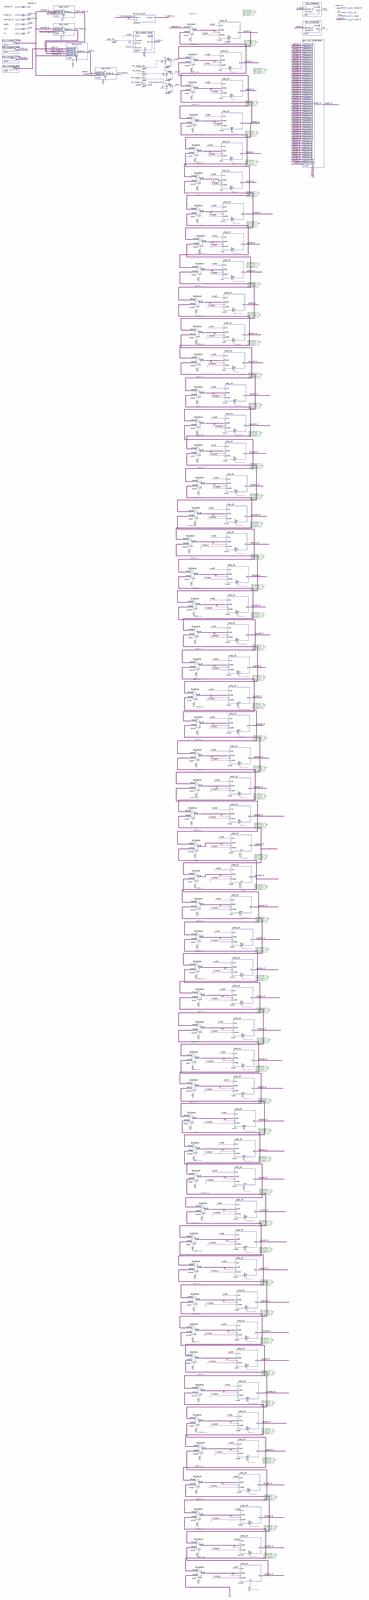
[diagram p0: schematic sheet, whole]
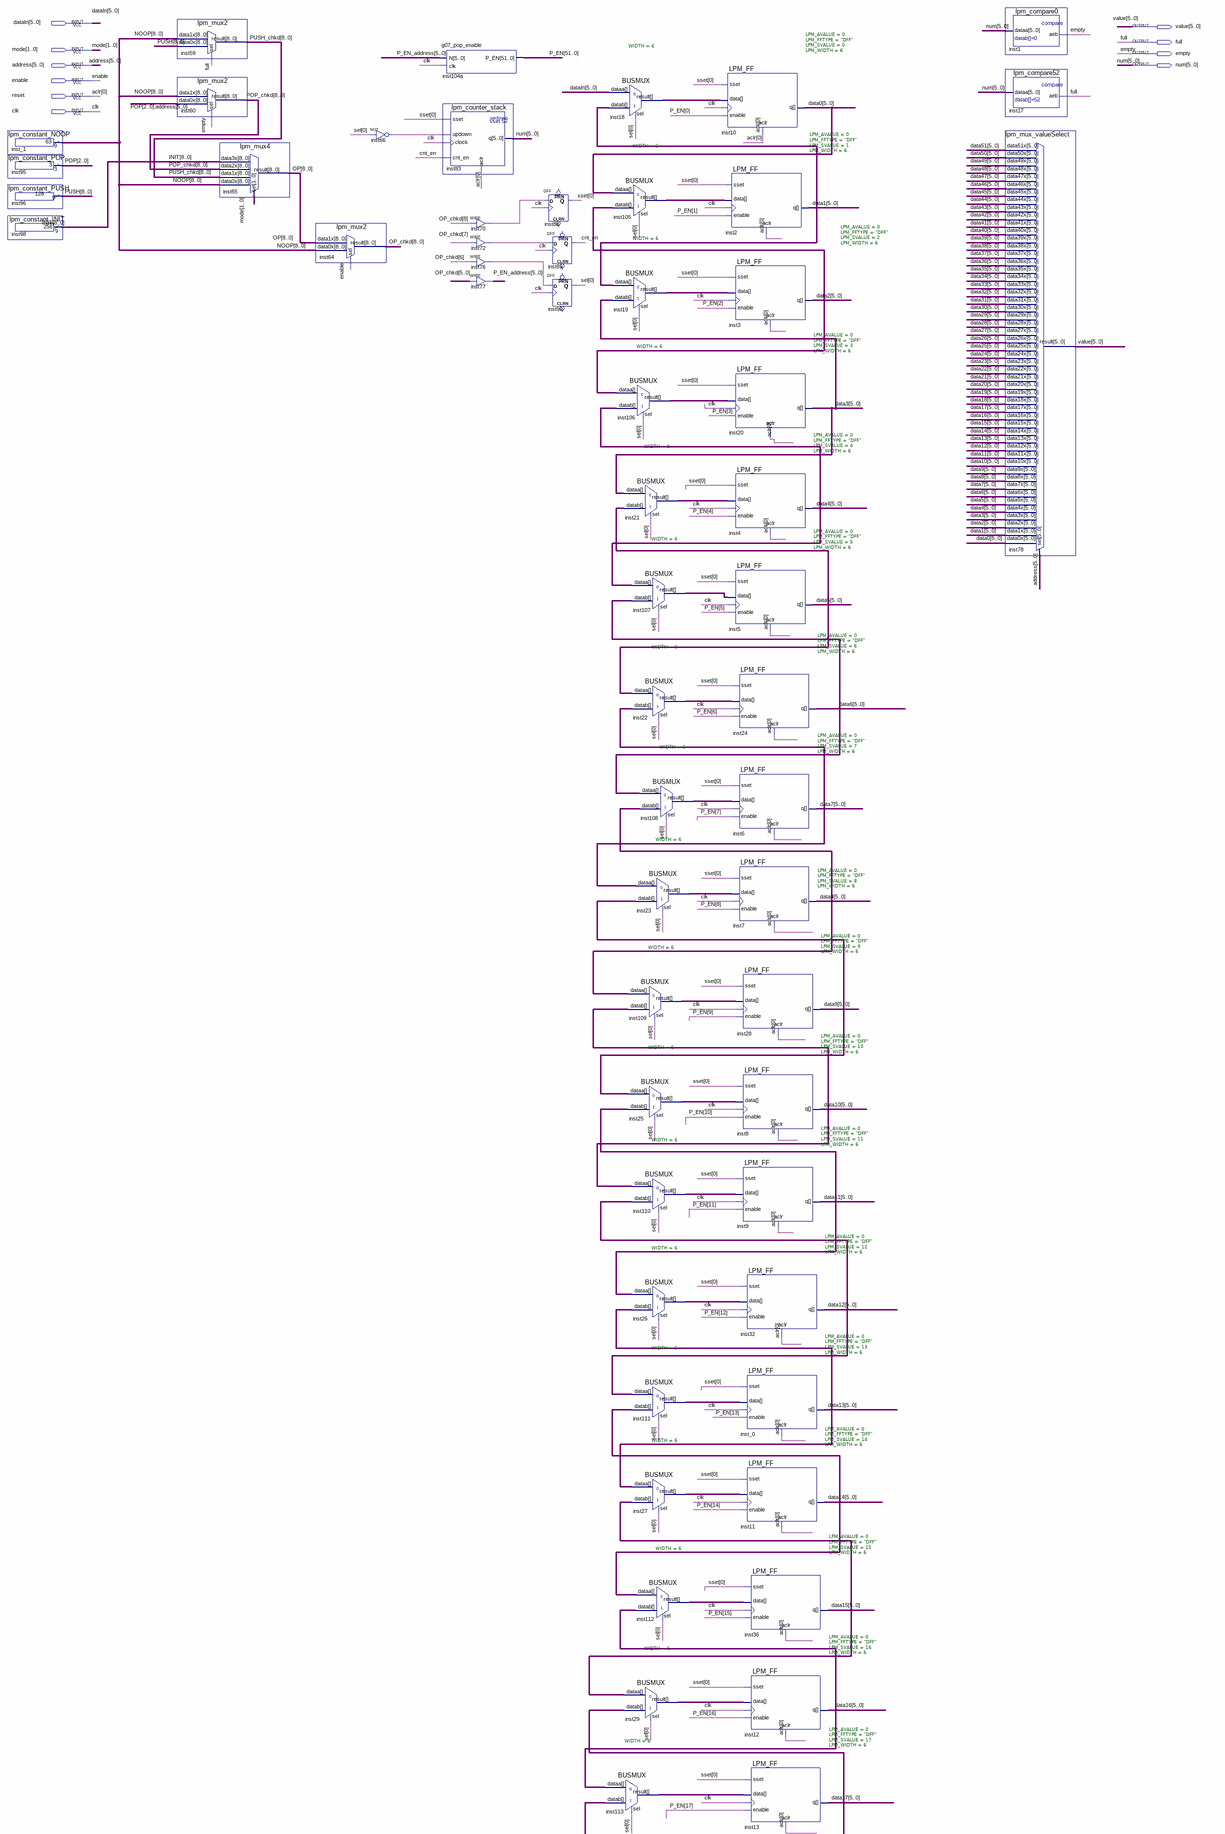
[diagram p1: schematic sheet, upper part]
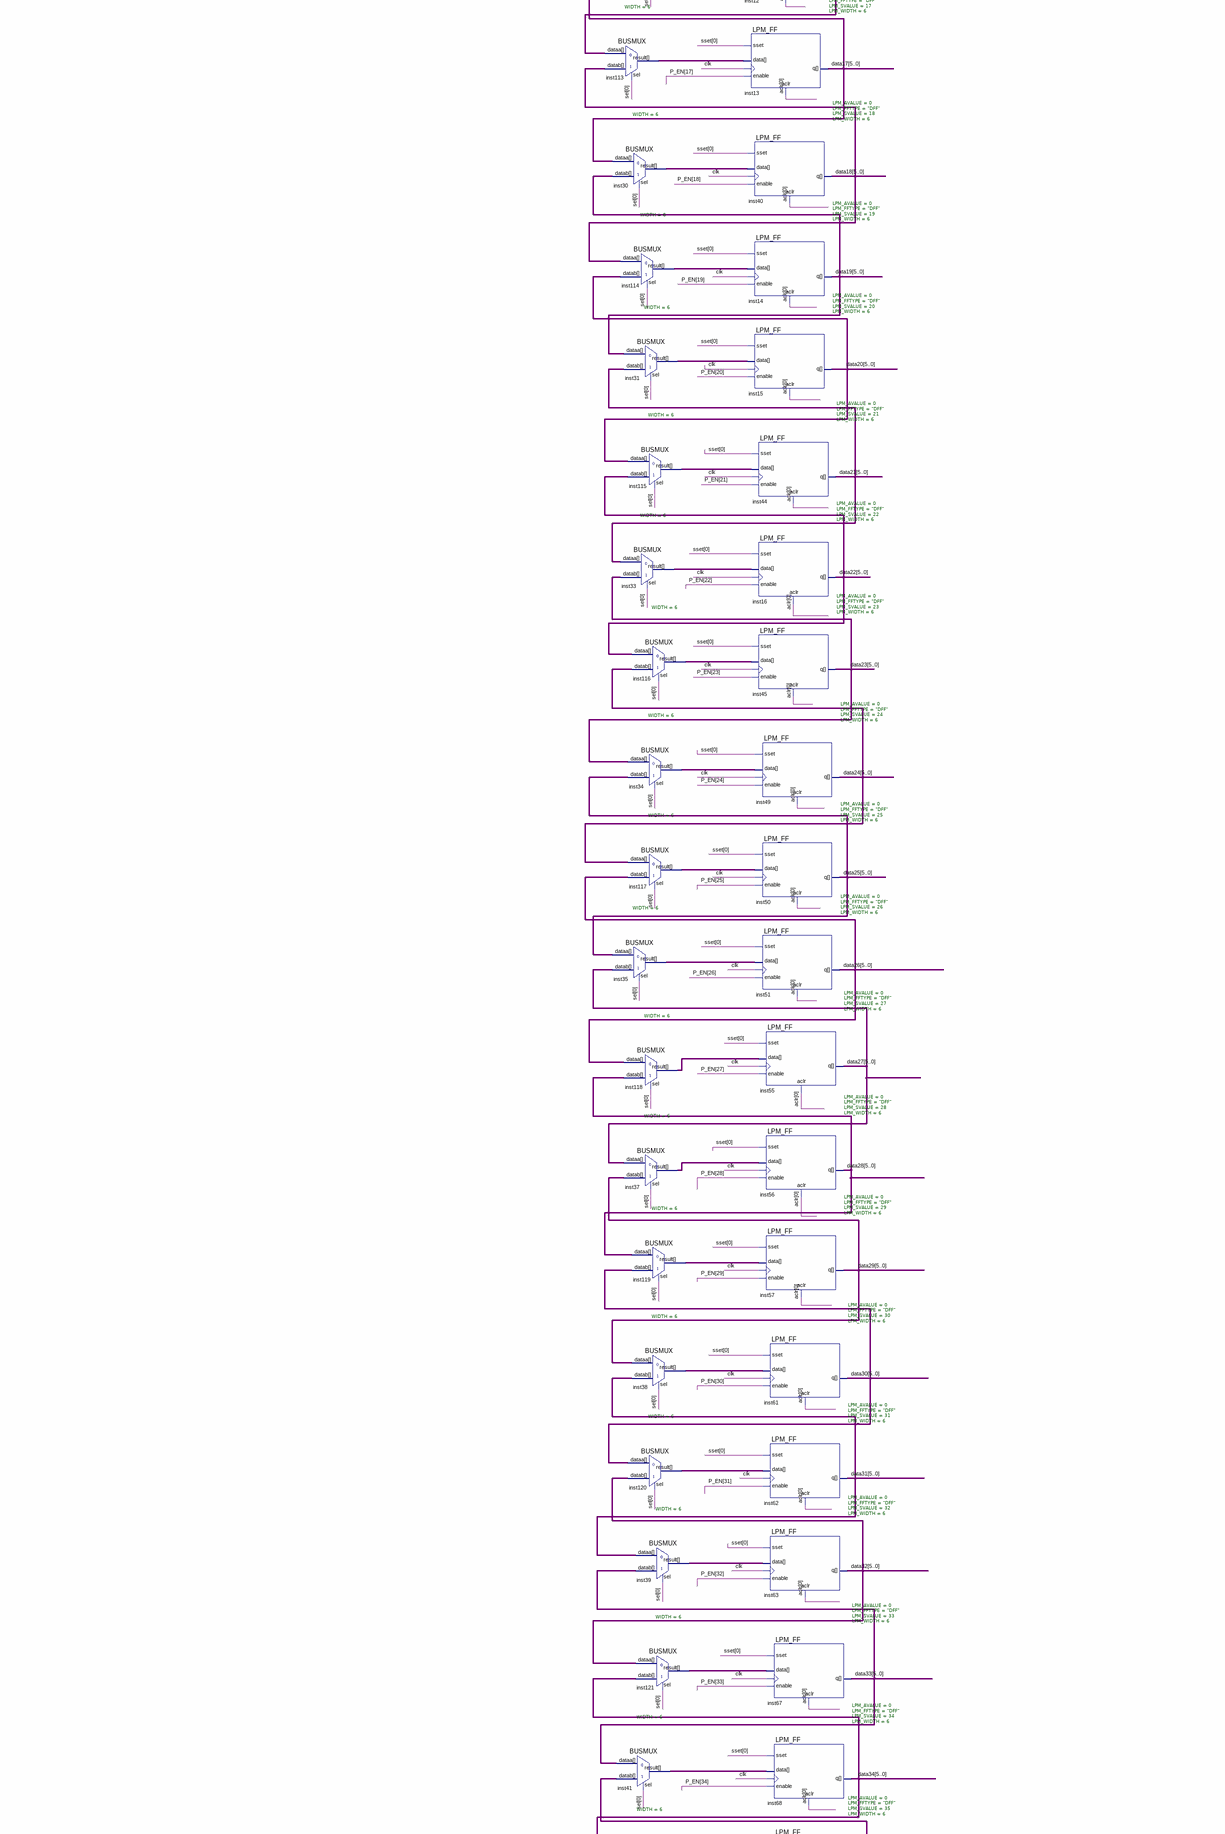
[diagram p2: schematic sheet, middle part]
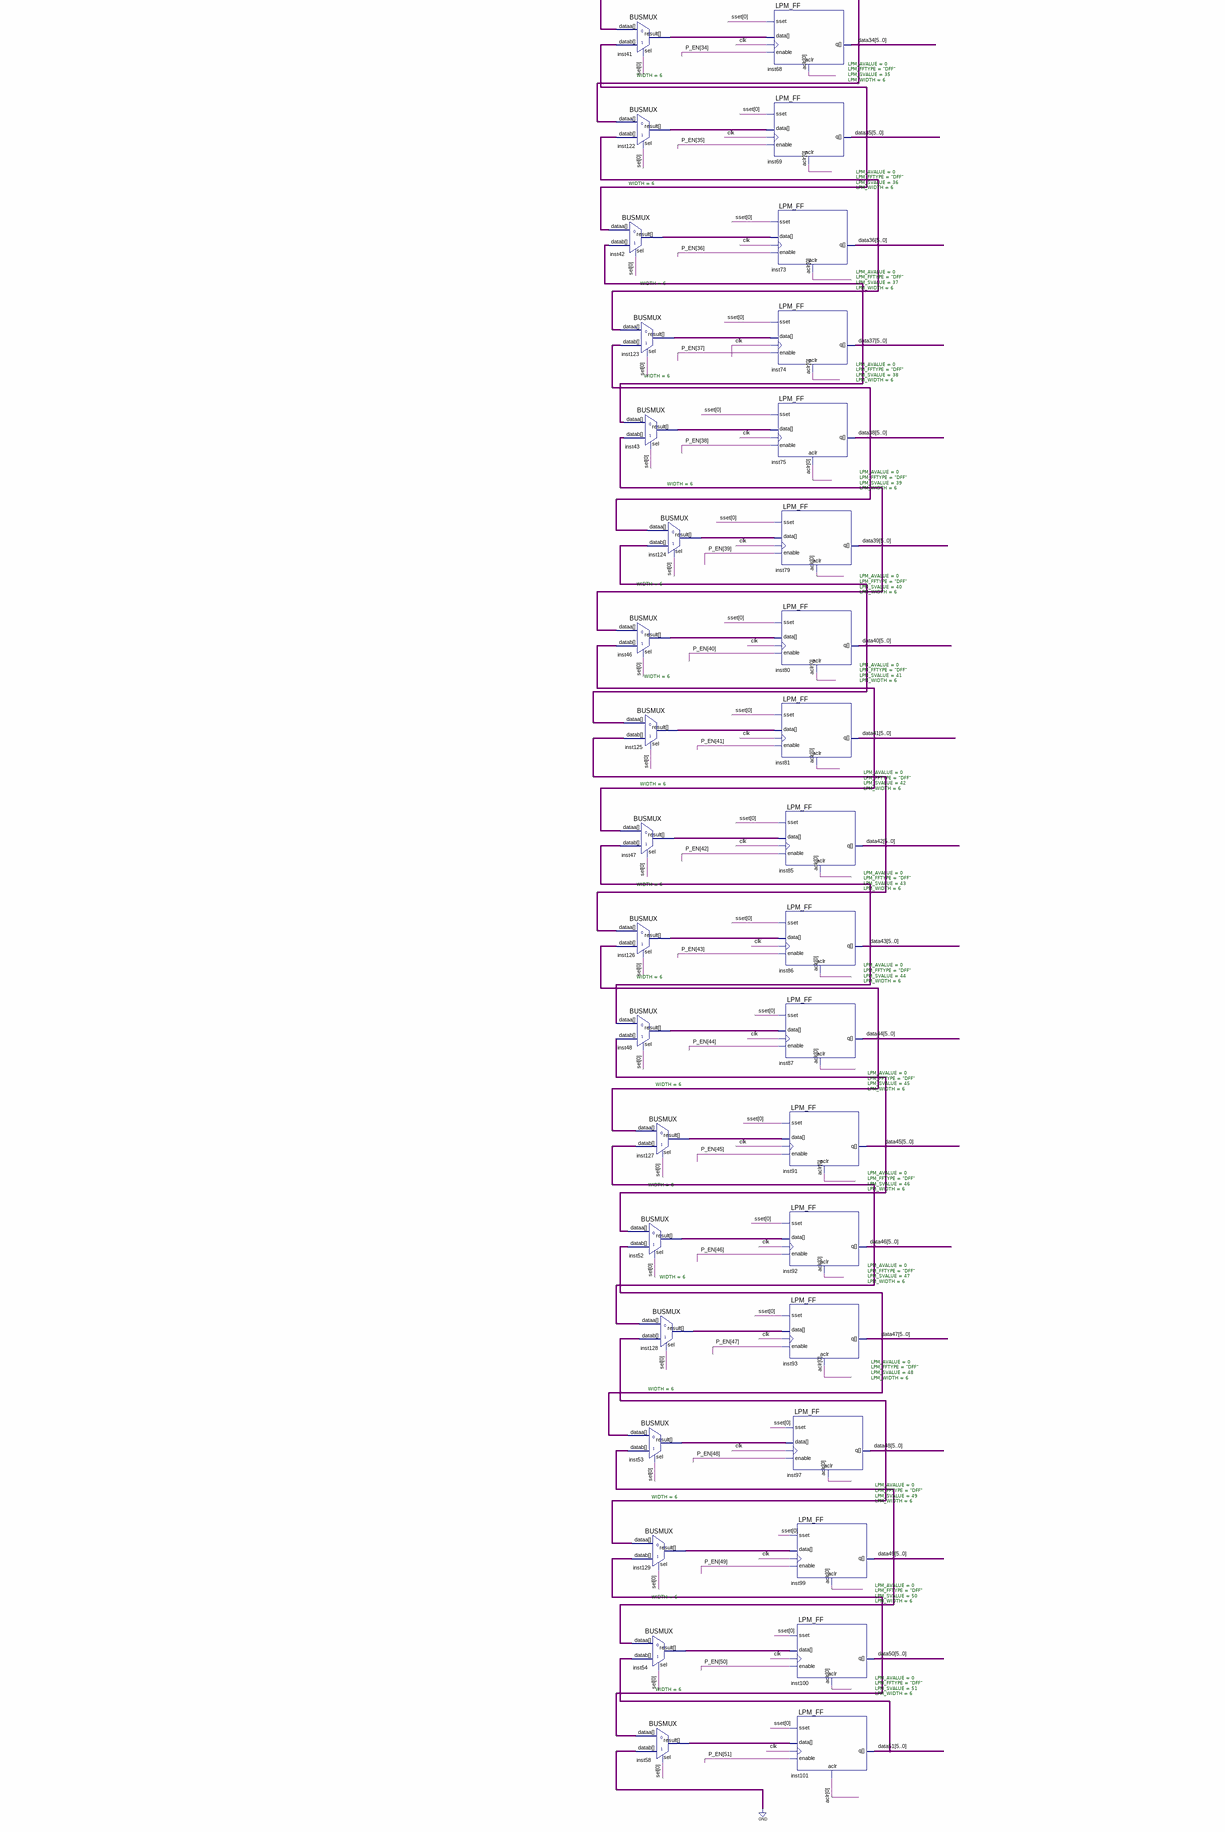
[diagram p3: schematic sheet, lower part]
// Quartus schematic g07_stack52.bdf as structural Verilog: 125 symbols, 10 pins
module g07_stack52 (
  input  [5:0] dataIn,
  input  [1:0] mode,
  input  [5:0] address,
  input  enable,
  input  reset,
  input  clk,
  output [5:0] value,
  output full,
  output empty,
  output [5:0] num
);

  wire cnt_en, inst66_out, inst70_out, inst72_out, inst76_out;
  wire [0:0] sel, sset;
  wire [2:0] POP;
  wire [5:0] data0, data1, data2, data3, data4, data5, data6, data7, data8, data9, data10, data11, data12,
       data13, data14, data15, data16, data17, data18, data19, data20, data21, data22, data23, data24,
       data25, data26, data27, data28, data29, data30, data31, data32, data33, data34, data35, data36,
       data37, data38, data39, data40, data41, data42, data43, data44, data45, data46, data47, data48,
       data49, data50, data51, inst18_result, inst19_result, inst21_result, inst22_result, inst23_result,
       inst25_result, inst26_result, inst27_result, inst29_result, inst30_result, inst31_result,
       inst33_result, inst34_result, inst35_result, inst37_result, inst38_result, inst39_result,
       inst41_result, inst42_result, inst43_result, inst46_result, inst47_result, inst48_result,
       inst52_result, inst53_result, inst54_result, inst58_result, inst105_result, inst106_result,
       inst107_result, inst108_result, inst109_result, inst110_result, inst111_result, inst112_result,
       inst113_result, inst114_result, inst115_result, inst116_result, inst117_result, inst118_result,
       inst119_result, inst120_result, inst121_result, inst122_result, inst123_result, inst124_result,
       inst125_result, inst126_result, inst127_result, inst128_result, inst129_result, P_EN_address;
  wire [8:0] INIT, NOOP, OP, OP_chkd, POP_chkd, PUSH, PUSH_chkd;
  wire [51:0] P_EN;

  lpm_constant_NOOP inst_1 (.result(NOOP));
  lpm_constant_POP inst95 (.result(POP));
  lpm_constant_PUSH inst96 (.result(PUSH));
  lpm_constant_INIT inst98 (.result(INIT));
  lpm_mux2 inst59 (.data1x(NOOP), .data0x(PUSH), .sel(full), .result(PUSH_chkd));
  lpm_mux2 inst60 (.data1x(NOOP), .data0x({POP, address}), .sel(empty), .result(POP_chkd));
  lpm_mux4 inst65 (.data3x(INIT), .data2x(POP_chkd), .data1x(PUSH_chkd), .data0x(NOOP), .sel(mode), .result(OP));
  lpm_mux2 inst64 (.data1x(OP), .data0x(NOOP), .sel(enable), .result(OP_chkd));
  not inst66 (inst66_out, sel[0]);
  g07_pop_enable inst104a (.N(P_EN_address), .clk(clk), .P_EN(P_EN));
  lpm_counter_stack inst83 (.sset(sset[0]), .updown(inst66_out), .clock(clk), .cnt_en(cnt_en), .aclr(reset), .q(num));
  assign inst70_out = OP_chkd[8];  // WIRE inst70
  assign inst72_out = OP_chkd[7];  // WIRE inst72
  assign inst76_out = OP_chkd[6];  // WIRE inst76
  assign P_EN_address = OP_chkd[5:0];  // WIRE inst77
  DFF inst88 (.CLK(clk), .D(inst70_out), .Q(sset[0]));  // open: CLRN, PRN
  DFF inst89 (.CLK(clk), .D(inst72_out), .Q(cnt_en));  // open: CLRN, PRN
  DFF inst90 (.CLK(clk), .D(inst76_out), .Q(sel[0]));  // open: CLRN, PRN
  BUSMUX #(.WIDTH(6)) inst18 (.datab(data1), .sel(sel[0]), .dataa(dataIn), .result(inst18_result));
  BUSMUX #(.WIDTH(6)) inst105 (.datab(data2), .sel(sel[0]), .dataa(data0), .result(inst105_result));
  BUSMUX #(.WIDTH(6)) inst19 (.datab(data3), .sel(sel[0]), .dataa(data1), .result(inst19_result));
  BUSMUX #(.WIDTH(6)) inst106 (.datab(data4), .sel(sel[0]), .dataa(data2), .result(inst106_result));
  BUSMUX #(.WIDTH(6)) inst21 (.datab(data5), .sel(sel[0]), .dataa(data3), .result(inst21_result));
  BUSMUX #(.WIDTH(6)) inst107 (.datab(data6), .sel(sel[0]), .dataa(data4), .result(inst107_result));
  BUSMUX #(.WIDTH(6)) inst22 (.datab(data7), .sel(sel[0]), .dataa(data5), .result(inst22_result));
  BUSMUX #(.WIDTH(6)) inst109 (.datab(data10), .sel(sel[0]), .dataa(data8), .result(inst109_result));
  BUSMUX #(.WIDTH(6)) inst25 (.datab(data11), .sel(sel[0]), .dataa(data9), .result(inst25_result));
  BUSMUX #(.WIDTH(6)) inst110 (.datab(data12), .sel(sel[0]), .dataa(data10), .result(inst110_result));
  BUSMUX #(.WIDTH(6)) inst26 (.datab(data13), .sel(sel[0]), .dataa(data11), .result(inst26_result));
  BUSMUX #(.WIDTH(6)) inst111 (.datab(data14), .sel(sel[0]), .dataa(data12), .result(inst111_result));
  BUSMUX #(.WIDTH(6)) inst27 (.datab(data15), .sel(sel[0]), .dataa(data13), .result(inst27_result));
  BUSMUX #(.WIDTH(6)) inst29 (.datab(data17), .sel(sel[0]), .dataa(data15), .result(inst29_result));
  BUSMUX #(.WIDTH(6)) inst113 (.datab(data18), .sel(sel[0]), .dataa(data16), .result(inst113_result));
  BUSMUX #(.WIDTH(6)) inst30 (.datab(data19), .sel(sel[0]), .dataa(data17), .result(inst30_result));
  BUSMUX #(.WIDTH(6)) inst114 (.datab(data20), .sel(sel[0]), .dataa(data18), .result(inst114_result));
  BUSMUX #(.WIDTH(6)) inst31 (.datab(data21), .sel(sel[0]), .dataa(data19), .result(inst31_result));
  BUSMUX #(.WIDTH(6)) inst115 (.datab(data22), .sel(sel[0]), .dataa(data20), .result(inst115_result));
  BUSMUX #(.WIDTH(6)) inst33 (.datab(data23), .sel(sel[0]), .dataa(data21), .result(inst33_result));
  BUSMUX #(.WIDTH(6)) inst116 (.datab(data24), .sel(sel[0]), .dataa(data22), .result(inst116_result));
  BUSMUX #(.WIDTH(6)) inst34 (.datab(data25), .sel(sel[0]), .dataa(data23), .result(inst34_result));
  BUSMUX #(.WIDTH(6)) inst117 (.datab(data26), .sel(sel[0]), .dataa(data24), .result(inst117_result));
  BUSMUX #(.WIDTH(6)) inst35 (.datab(data27), .sel(sel[0]), .dataa(data25), .result(inst35_result));
  BUSMUX #(.WIDTH(6)) inst118 (.datab(data28), .sel(sel[0]), .dataa(data26), .result(inst118_result));
  BUSMUX #(.WIDTH(6)) inst37 (.datab(data29), .sel(sel[0]), .dataa(data27), .result(inst37_result));
  BUSMUX #(.WIDTH(6)) inst119 (.datab(data30), .sel(sel[0]), .dataa(data28), .result(inst119_result));
  BUSMUX #(.WIDTH(6)) inst38 (.datab(data31), .sel(sel[0]), .dataa(data29), .result(inst38_result));
  BUSMUX #(.WIDTH(6)) inst120 (.datab(data32), .sel(sel[0]), .dataa(data30), .result(inst120_result));
  BUSMUX #(.WIDTH(6)) inst41 (.datab(data35), .sel(sel[0]), .dataa(data33), .result(inst41_result));
  BUSMUX #(.WIDTH(6)) inst122 (.datab(data36), .sel(sel[0]), .dataa(data34), .result(inst122_result));
  BUSMUX #(.WIDTH(6)) inst42 (.datab(data37), .sel(sel[0]), .dataa(data35), .result(inst42_result));
  BUSMUX #(.WIDTH(6)) inst123 (.datab(data38), .sel(sel[0]), .dataa(data36), .result(inst123_result));
  BUSMUX #(.WIDTH(6)) inst43 (.datab(data39), .sel(sel[0]), .dataa(data37), .result(inst43_result));
  BUSMUX #(.WIDTH(6)) inst46 (.datab(data41), .sel(sel[0]), .dataa(data39), .result(inst46_result));
  BUSMUX #(.WIDTH(6)) inst125 (.datab(data42), .sel(sel[0]), .dataa(data40), .result(inst125_result));
  BUSMUX #(.WIDTH(6)) inst47 (.datab(data43), .sel(sel[0]), .dataa(data41), .result(inst47_result));
  BUSMUX #(.WIDTH(6)) inst126 (.datab(data44), .sel(sel[0]), .dataa(data42), .result(inst126_result));
  BUSMUX #(.WIDTH(6)) inst48 (.datab(data45), .sel(sel[0]), .dataa(data43), .result(inst48_result));
  BUSMUX #(.WIDTH(6)) inst52 (.datab(data47), .sel(sel[0]), .dataa(data45), .result(inst52_result));
  BUSMUX #(.WIDTH(6)) inst53 (.datab(data49), .sel(sel[0]), .dataa(data47), .result(inst53_result));
  BUSMUX #(.WIDTH(6)) inst129 (.datab(data50), .sel(sel[0]), .dataa(data48), .result(inst129_result));
  BUSMUX #(.WIDTH(6)) inst54 (.datab(data51), .sel(sel[0]), .dataa(data49), .result(inst54_result));
  BUSMUX #(.WIDTH(6)) inst108 (.datab(data8), .sel(sel[0]), .dataa(data6), .result(inst108_result));
  BUSMUX #(.WIDTH(6)) inst23 (.datab(data9), .sel(sel[0]), .dataa(data7), .result(inst23_result));
  BUSMUX #(.WIDTH(6)) inst112 (.datab(data16), .sel(sel[0]), .dataa(data14), .result(inst112_result));
  BUSMUX #(.WIDTH(6)) inst39 (.datab(data33), .sel(sel[0]), .dataa(data31), .result(inst39_result));
  BUSMUX #(.WIDTH(6)) inst121 (.datab(data34), .sel(sel[0]), .dataa(data32), .result(inst121_result));
  BUSMUX #(.WIDTH(6)) inst124 (.datab(data40), .sel(sel[0]), .dataa(data38), .result(inst124_result));
  BUSMUX #(.WIDTH(6)) inst127 (.datab(data46), .sel(sel[0]), .dataa(data44), .result(inst127_result));
  BUSMUX #(.WIDTH(6)) inst128 (.datab(data48), .sel(sel[0]), .dataa(data46), .result(inst128_result));
  BUSMUX #(.WIDTH(6)) inst58 (.datab({6{1'b0}}), .sel(sel[0]), .dataa(data50), .result(inst58_result));
  LPM_FF #(.LPM_AVALUE(0), .LPM_FFTYPE("DFF"), .LPM_SVALUE(0), .LPM_WIDTH(6)) inst10 (
    .enable(P_EN[0]), .clock(clk), .sset(sset[0]), .aclr(reset), .data(inst18_result), .q(data0));
  LPM_FF #(.LPM_AVALUE(0), .LPM_FFTYPE("DFF"), .LPM_SVALUE(1), .LPM_WIDTH(6)) inst2 (
    .enable(P_EN[1]), .clock(clk), .sset(sset[0]), .aclr(reset), .data(inst105_result), .q(data1));
  LPM_FF #(.LPM_AVALUE(0), .LPM_FFTYPE("DFF"), .LPM_SVALUE(2), .LPM_WIDTH(6)) inst3 (
    .enable(P_EN[2]), .clock(clk), .sset(sset[0]), .aclr(reset), .data(inst19_result), .q(data2));
  LPM_FF #(.LPM_AVALUE(0), .LPM_FFTYPE("DFF"), .LPM_SVALUE(3), .LPM_WIDTH(6)) inst20 (
    .enable(P_EN[3]), .clock(clk), .sset(sset[0]), .aclr(reset), .data(inst106_result), .q(data3));
  LPM_FF #(.LPM_AVALUE(0), .LPM_FFTYPE("DFF"), .LPM_SVALUE(4), .LPM_WIDTH(6)) inst4 (
    .enable(P_EN[4]), .clock(clk), .sset(sset[0]), .aclr(reset), .data(inst21_result), .q(data4));
  LPM_FF #(.LPM_AVALUE(0), .LPM_FFTYPE("DFF"), .LPM_SVALUE(5), .LPM_WIDTH(6)) inst5 (
    .enable(P_EN[5]), .clock(clk), .sset(sset[0]), .aclr(reset), .data(inst107_result), .q(data5));
  LPM_FF #(.LPM_AVALUE(0), .LPM_FFTYPE("DFF"), .LPM_SVALUE(6), .LPM_WIDTH(6)) inst24 (
    .enable(P_EN[6]), .clock(clk), .sset(sset[0]), .aclr(reset), .data(inst22_result), .q(data6));
  LPM_FF #(.LPM_AVALUE(0), .LPM_FFTYPE("DFF"), .LPM_SVALUE(7), .LPM_WIDTH(6)) inst6 (
    .enable(P_EN[7]), .clock(clk), .sset(sset[0]), .aclr(reset), .data(inst108_result), .q(data7));
  LPM_FF #(.LPM_AVALUE(0), .LPM_FFTYPE("DFF"), .LPM_SVALUE(8), .LPM_WIDTH(6)) inst7 (
    .enable(P_EN[8]), .clock(clk), .sset(sset[0]), .aclr(reset), .data(inst23_result), .q(data8));
  LPM_FF #(.LPM_AVALUE(0), .LPM_FFTYPE("DFF"), .LPM_SVALUE(9), .LPM_WIDTH(6)) inst28 (
    .enable(P_EN[9]), .clock(clk), .sset(sset[0]), .aclr(reset), .data(inst109_result), .q(data9));
  LPM_FF #(.LPM_AVALUE(0), .LPM_FFTYPE("DFF"), .LPM_SVALUE(10), .LPM_WIDTH(6)) inst8 (
    .enable(P_EN[10]), .clock(clk), .sset(sset[0]), .aclr(reset), .data(inst25_result), .q(data10));
  LPM_FF #(.LPM_AVALUE(0), .LPM_FFTYPE("DFF"), .LPM_SVALUE(11), .LPM_WIDTH(6)) inst9 (
    .enable(P_EN[11]), .clock(clk), .sset(sset[0]), .aclr(reset), .data(inst110_result), .q(data11));
  LPM_FF #(.LPM_AVALUE(0), .LPM_FFTYPE("DFF"), .LPM_SVALUE(12), .LPM_WIDTH(6)) inst32 (
    .enable(P_EN[12]), .clock(clk), .sset(sset[0]), .aclr(reset), .data(inst26_result), .q(data12));
  LPM_FF #(.LPM_AVALUE(0), .LPM_FFTYPE("DFF"), .LPM_SVALUE(13), .LPM_WIDTH(6)) inst_0 (
    .enable(P_EN[13]), .clock(clk), .sset(sset[0]), .aclr(reset), .data(inst111_result), .q(data13));
  LPM_FF #(.LPM_AVALUE(0), .LPM_FFTYPE("DFF"), .LPM_SVALUE(14), .LPM_WIDTH(6)) inst11 (
    .enable(P_EN[14]), .clock(clk), .sset(sset[0]), .aclr(reset), .data(inst27_result), .q(data14));
  LPM_FF #(.LPM_AVALUE(0), .LPM_FFTYPE("DFF"), .LPM_SVALUE(15), .LPM_WIDTH(6)) inst36 (
    .enable(P_EN[15]), .clock(clk), .sset(sset[0]), .aclr(reset), .data(inst112_result), .q(data15));
  LPM_FF #(.LPM_AVALUE(0), .LPM_FFTYPE("DFF"), .LPM_SVALUE(16), .LPM_WIDTH(6)) inst12 (
    .enable(P_EN[16]), .clock(clk), .sset(sset[0]), .aclr(reset), .data(inst29_result), .q(data16));
  LPM_FF #(.LPM_AVALUE(0), .LPM_FFTYPE("DFF"), .LPM_SVALUE(17), .LPM_WIDTH(6)) inst13 (
    .enable(P_EN[17]), .clock(clk), .sset(sset[0]), .aclr(reset), .data(inst113_result), .q(data17));
  LPM_FF #(.LPM_AVALUE(0), .LPM_FFTYPE("DFF"), .LPM_SVALUE(18), .LPM_WIDTH(6)) inst40 (
    .enable(P_EN[18]), .clock(clk), .sset(sset[0]), .aclr(reset), .data(inst30_result), .q(data18));
  LPM_FF #(.LPM_AVALUE(0), .LPM_FFTYPE("DFF"), .LPM_SVALUE(19), .LPM_WIDTH(6)) inst14 (
    .enable(P_EN[19]), .clock(clk), .sset(sset[0]), .aclr(reset), .data(inst114_result), .q(data19));
  LPM_FF #(.LPM_AVALUE(0), .LPM_FFTYPE("DFF"), .LPM_SVALUE(20), .LPM_WIDTH(6)) inst15 (
    .enable(P_EN[20]), .clock(clk), .sset(sset[0]), .aclr(reset), .data(inst31_result), .q(data20));
  LPM_FF #(.LPM_AVALUE(0), .LPM_FFTYPE("DFF"), .LPM_SVALUE(21), .LPM_WIDTH(6)) inst44 (
    .enable(P_EN[21]), .clock(clk), .sset(sset[0]), .aclr(reset), .data(inst115_result), .q(data21));
  LPM_FF #(.LPM_AVALUE(0), .LPM_FFTYPE("DFF"), .LPM_SVALUE(22), .LPM_WIDTH(6)) inst16 (
    .enable(P_EN[22]), .clock(clk), .sset(sset[0]), .aclr(reset), .data(inst33_result), .q(data22));
  LPM_FF #(.LPM_AVALUE(0), .LPM_FFTYPE("DFF"), .LPM_SVALUE(23), .LPM_WIDTH(6)) inst45 (
    .enable(P_EN[23]), .clock(clk), .sset(sset[0]), .aclr(reset), .data(inst116_result), .q(data23));
  LPM_FF #(.LPM_AVALUE(0), .LPM_FFTYPE("DFF"), .LPM_SVALUE(24), .LPM_WIDTH(6)) inst49 (
    .enable(P_EN[24]), .clock(clk), .sset(sset[0]), .aclr(reset), .data(inst34_result), .q(data24));
  LPM_FF #(.LPM_AVALUE(0), .LPM_FFTYPE("DFF"), .LPM_SVALUE(25), .LPM_WIDTH(6)) inst50 (
    .enable(P_EN[25]), .clock(clk), .sset(sset[0]), .aclr(reset), .data(inst117_result), .q(data25));
  LPM_FF #(.LPM_AVALUE(0), .LPM_FFTYPE("DFF"), .LPM_SVALUE(26), .LPM_WIDTH(6)) inst51 (
    .enable(P_EN[26]), .clock(clk), .sset(sset[0]), .aclr(reset), .data(inst35_result), .q(data26));
  LPM_FF #(.LPM_AVALUE(0), .LPM_FFTYPE("DFF"), .LPM_SVALUE(27), .LPM_WIDTH(6)) inst55 (
    .enable(P_EN[27]), .clock(clk), .sset(sset[0]), .aclr(reset), .data(inst118_result), .q(data27));
  LPM_FF #(.LPM_AVALUE(0), .LPM_FFTYPE("DFF"), .LPM_SVALUE(28), .LPM_WIDTH(6)) inst56 (
    .enable(P_EN[28]), .clock(clk), .sset(sset[0]), .aclr(reset), .data(inst37_result), .q(data28));
  LPM_FF #(.LPM_AVALUE(0), .LPM_FFTYPE("DFF"), .LPM_SVALUE(29), .LPM_WIDTH(6)) inst57 (
    .enable(P_EN[29]), .clock(clk), .sset(sset[0]), .aclr(reset), .data(inst119_result), .q(data29));
  LPM_FF #(.LPM_AVALUE(0), .LPM_FFTYPE("DFF"), .LPM_SVALUE(30), .LPM_WIDTH(6)) inst61 (
    .enable(P_EN[30]), .clock(clk), .sset(sset[0]), .aclr(reset), .data(inst38_result), .q(data30));
  LPM_FF #(.LPM_AVALUE(0), .LPM_FFTYPE("DFF"), .LPM_SVALUE(31), .LPM_WIDTH(6)) inst62 (
    .enable(P_EN[31]), .clock(clk), .sset(sset[0]), .aclr(reset), .data(inst120_result), .q(data31));
  LPM_FF #(.LPM_AVALUE(0), .LPM_FFTYPE("DFF"), .LPM_SVALUE(32), .LPM_WIDTH(6)) inst63 (
    .enable(P_EN[32]), .clock(clk), .sset(sset[0]), .aclr(reset), .data(inst39_result), .q(data32));
  LPM_FF #(.LPM_AVALUE(0), .LPM_FFTYPE("DFF"), .LPM_SVALUE(33), .LPM_WIDTH(6)) inst67 (
    .enable(P_EN[33]), .clock(clk), .sset(sset[0]), .aclr(reset), .data(inst121_result), .q(data33));
  LPM_FF #(.LPM_AVALUE(0), .LPM_FFTYPE("DFF"), .LPM_SVALUE(34), .LPM_WIDTH(6)) inst68 (
    .enable(P_EN[34]), .clock(clk), .sset(sset[0]), .aclr(reset), .data(inst41_result), .q(data34));
  LPM_FF #(.LPM_AVALUE(0), .LPM_FFTYPE("DFF"), .LPM_SVALUE(35), .LPM_WIDTH(6)) inst69 (
    .enable(P_EN[35]), .clock(clk), .sset(sset[0]), .aclr(reset), .data(inst122_result), .q(data35));
  LPM_FF #(.LPM_AVALUE(0), .LPM_FFTYPE("DFF"), .LPM_SVALUE(36), .LPM_WIDTH(6)) inst73 (
    .enable(P_EN[36]), .clock(clk), .sset(sset[0]), .aclr(reset), .data(inst42_result), .q(data36));
  LPM_FF #(.LPM_AVALUE(0), .LPM_FFTYPE("DFF"), .LPM_SVALUE(37), .LPM_WIDTH(6)) inst74 (
    .enable(P_EN[37]), .clock(clk), .sset(sset[0]), .aclr(reset), .data(inst123_result), .q(data37));
  LPM_FF #(.LPM_AVALUE(0), .LPM_FFTYPE("DFF"), .LPM_SVALUE(38), .LPM_WIDTH(6)) inst75 (
    .enable(P_EN[38]), .clock(clk), .sset(sset[0]), .aclr(reset), .data(inst43_result), .q(data38));
  LPM_FF #(.LPM_AVALUE(0), .LPM_FFTYPE("DFF"), .LPM_SVALUE(39), .LPM_WIDTH(6)) inst79 (
    .enable(P_EN[39]), .clock(clk), .sset(sset[0]), .aclr(reset), .data(inst124_result), .q(data39));
  LPM_FF #(.LPM_AVALUE(0), .LPM_FFTYPE("DFF"), .LPM_SVALUE(40), .LPM_WIDTH(6)) inst80 (
    .enable(P_EN[40]), .clock(clk), .sset(sset[0]), .aclr(reset), .data(inst46_result), .q(data40));
  LPM_FF #(.LPM_AVALUE(0), .LPM_FFTYPE("DFF"), .LPM_SVALUE(41), .LPM_WIDTH(6)) inst81 (
    .enable(P_EN[41]), .clock(clk), .sset(sset[0]), .aclr(reset), .data(inst125_result), .q(data41));
  LPM_FF #(.LPM_AVALUE(0), .LPM_FFTYPE("DFF"), .LPM_SVALUE(42), .LPM_WIDTH(6)) inst85 (
    .enable(P_EN[42]), .clock(clk), .sset(sset[0]), .aclr(reset), .data(inst47_result), .q(data42));
  LPM_FF #(.LPM_AVALUE(0), .LPM_FFTYPE("DFF"), .LPM_SVALUE(43), .LPM_WIDTH(6)) inst86 (
    .enable(P_EN[43]), .clock(clk), .sset(sset[0]), .aclr(reset), .data(inst126_result), .q(data43));
  LPM_FF #(.LPM_AVALUE(0), .LPM_FFTYPE("DFF"), .LPM_SVALUE(44), .LPM_WIDTH(6)) inst87 (
    .enable(P_EN[44]), .clock(clk), .sset(sset[0]), .aclr(reset), .data(inst48_result), .q(data44));
  LPM_FF #(.LPM_AVALUE(0), .LPM_FFTYPE("DFF"), .LPM_SVALUE(45), .LPM_WIDTH(6)) inst91 (
    .enable(P_EN[45]), .clock(clk), .sset(sset[0]), .aclr(reset), .data(inst127_result), .q(data45));
  LPM_FF #(.LPM_AVALUE(0), .LPM_FFTYPE("DFF"), .LPM_SVALUE(46), .LPM_WIDTH(6)) inst92 (
    .enable(P_EN[46]), .clock(clk), .sset(sset[0]), .aclr(reset), .data(inst52_result), .q(data46));
  LPM_FF #(.LPM_AVALUE(0), .LPM_FFTYPE("DFF"), .LPM_SVALUE(47), .LPM_WIDTH(6)) inst93 (
    .enable(P_EN[47]), .clock(clk), .sset(sset[0]), .aclr(reset), .data(inst128_result), .q(data47));
  LPM_FF #(.LPM_AVALUE(0), .LPM_FFTYPE("DFF"), .LPM_SVALUE(48), .LPM_WIDTH(6)) inst97 (
    .enable(P_EN[48]), .clock(clk), .sset(sset[0]), .aclr(reset), .data(inst53_result), .q(data48));
  LPM_FF #(.LPM_AVALUE(0), .LPM_FFTYPE("DFF"), .LPM_SVALUE(49), .LPM_WIDTH(6)) inst99 (
    .enable(P_EN[49]), .clock(clk), .sset(sset[0]), .aclr(reset), .data(inst129_result), .q(data49));
  LPM_FF #(.LPM_AVALUE(0), .LPM_FFTYPE("DFF"), .LPM_SVALUE(50), .LPM_WIDTH(6)) inst100 (
    .enable(P_EN[50]), .clock(clk), .sset(sset[0]), .aclr(reset), .data(inst54_result), .q(data50));
  LPM_FF #(.LPM_AVALUE(0), .LPM_FFTYPE("DFF"), .LPM_SVALUE(51), .LPM_WIDTH(6)) inst101 (
    .enable(P_EN[51]), .clock(clk), .sset(sset[0]), .aclr(reset), .data(inst58_result), .q(data51));
  lpm_compare0 inst1 (.dataa(num), .aeb(empty));
  lpm_compare52 inst17 (.dataa(num), .aeb(full));
  lpm_mux_valueSelect inst78 (
    .data51x(data51), .data50x(data50), .data49x(data49), .data48x(data48), .data47x(data47),
    .data46x(data46), .data45x(data45), .data44x(data44), .data43x(data43), .data42x(data42),
    .data41x(data41), .data40x(data40), .data39x(data39), .data38x(data38), .data37x(data37),
    .data36x(data36), .data35x(data35), .data34x(data34), .data33x(data33), .data32x(data32),
    .data31x(data31), .data30x(data30), .data29x(data29), .data28x(data28), .data27x(data27),
    .data26x(data26), .data25x(data25), .data24x(data24), .data23x(data23), .data22x(data22),
    .data21x(data21), .data20x(data20), .data19x(data19), .data18x(data18), .data17x(data17),
    .data16x(data16), .data15x(data15), .data14x(data14), .data13x(data13), .data12x(data12),
    .data11x(data11), .data10x(data10), .data9x(data9), .data8x(data8), .data7x(data7), .data6x(data6),
    .data5x(data5), .data4x(data4), .data3x(data3), .data2x(data2), .data1x(data1), .data0x(data0),
    .sel(address), .result(value));

  // Other names for the same wires on the sheet: aclr[0] = reset
endmodule
